# EAGLE schematic Eagle-Example (EAGLE 7.5.0)
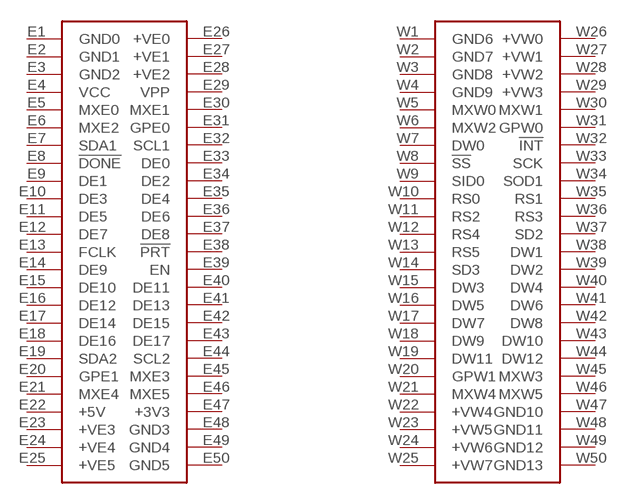
[diagram p0: schematic, sheet 1]

## Parts
T1  MEZZANINE  [MEZZANINE]
Unconnected: T1.E5(MXE0) T1.E6(MXE2) T1.E7(SDA1) T1.E8(!DONE) T1.E9(DE1) T1.E10(DE3) T1.E11(DE5) T1.E12(DE7) T1.E13(FCLK) T1.E14(DE9) T1.E15(DE10) T1.E16(DE12) T1.E17(DE14) T1.E18(DE16) T1.E19(SDA2) T1.E20(GPE1) T1.E21(MXE4) T1.E30(MXE1) T1.E31(GPE0) T1.E32(SCL1) T1.E33(DE0) T1.E34(DE2) T1.E35(DE4) T1.E36(DE6) T1.E37(DE8) T1.E38(!PRT) T1.E39(EN) T1.E40(DE11) T1.E41(DE13) T1.E42(DE15) T1.E43(DE17) T1.E44(SCL2) T1.E45(MXE3) T1.E46(MXE5) T1.W5(MXW0) T1.W6(MXW2) T1.W7(DW0) T1.W8(!SS) T1.W9(SID0) T1.W10(RS0) T1.W11(RS2) T1.W12(RS4) T1.W13(RS5) T1.W14(SD3) T1.W15(DW3) T1.W16(DW5) T1.W17(DW7) T1.W18(DW9) T1.W19(DW11) T1.W20(GPW1) T1.W21(MXW4) T1.W27(+VW1) T1.W30(MXW1) T1.W31(GPW0) T1.W32(!INT) T1.W33(SCK) T1.W34(SOD1) T1.W35(RS1) T1.W36(RS3) T1.W37(SD2) T1.W38(DW1) T1.W39(DW2) T1.W40(DW4) T1.W41(DW6) T1.W42(DW8) T1.W43(DW10) T1.W44(DW12) T1.W45(MXW3) T1.W46(MXW5)

## Power pins joined to a net without a drawn wire
+3V3: T1.E47(+3V3)
+5V: T1.E22(+5V)
+VE0: T1.E26(+VE0)
+VE1: T1.E27(+VE1)
+VE2: T1.E28(+VE2)
+VE3: T1.E23(+VE3)
+VE4: T1.E24(+VE4)
+VE5: T1.E25(+VE5)
+VW0: T1.W26(+VW0)
+VW2: T1.W28(+VW2)
+VW3: T1.W29(+VW3)
+VW4: T1.W22(+VW4)
+VW5: T1.W23(+VW5)
+VW6: T1.W24(+VW6)
+VW7: T1.W25(+VW7)
GND0: T1.E1(GND0)
GND1: T1.E2(GND1)
GND2: T1.E3(GND2)
GND3: T1.E48(GND3)
GND4: T1.E49(GND4)
GND5: T1.E50(GND5)
GND6: T1.W1(GND6)
GND7: T1.W2(GND7)
GND8: T1.W3(GND8)
GND9: T1.W4(GND9)
GND10: T1.W47(GND10)
GND11: T1.W48(GND11)
GND12: T1.W49(GND12)
GND13: T1.W50(GND13)
VCC: T1.E4(VCC)
VPP: T1.E29(VPP)

## Library data of the parts
T1 = amino:MEZZANINE